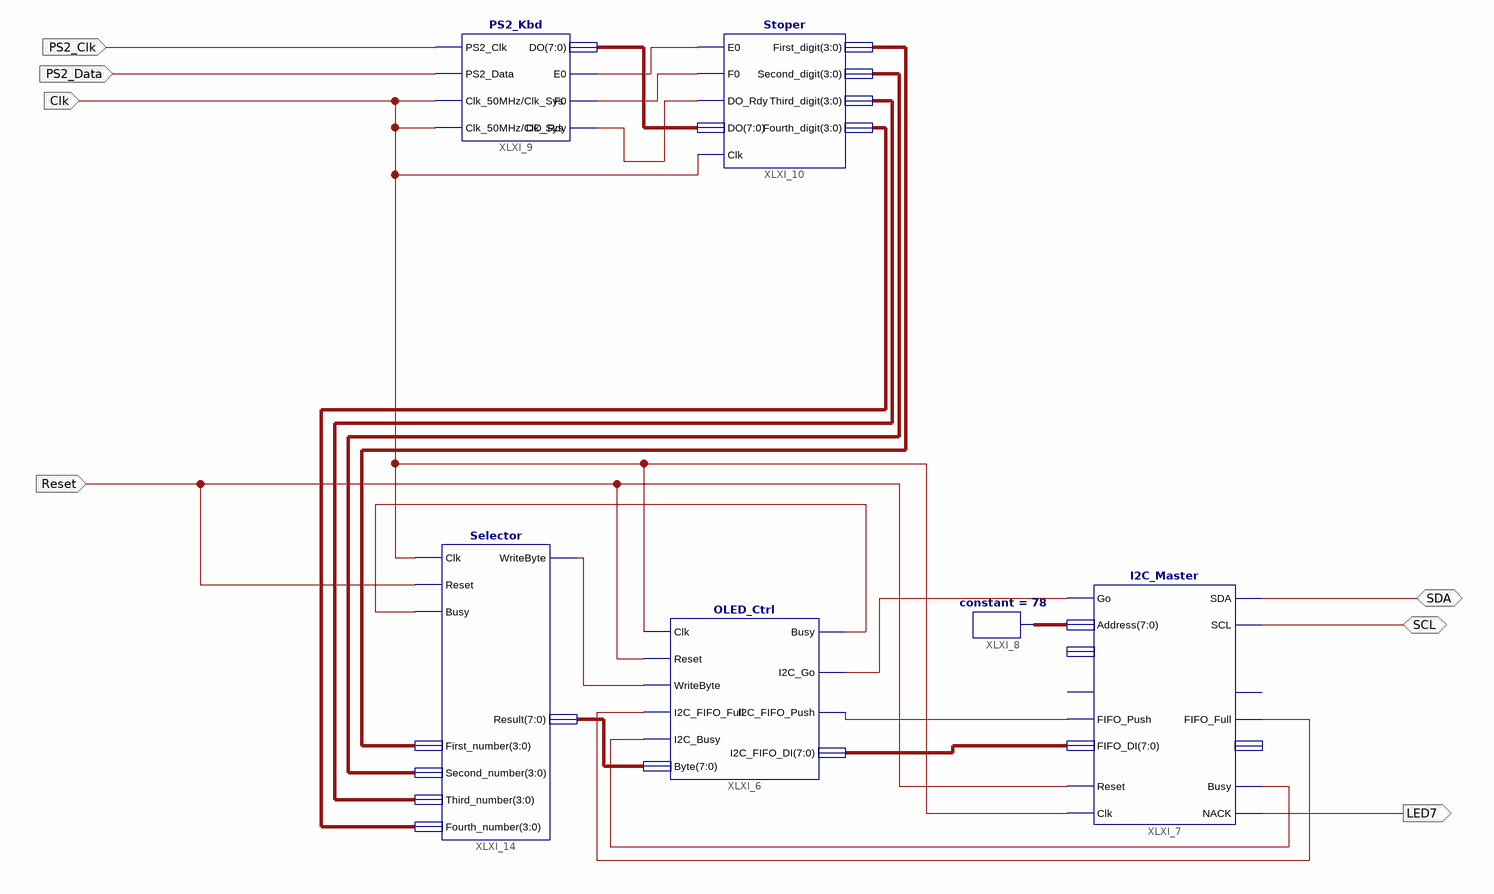
[diagram p0: schematic sheet 1]
// Xilinx ISE schematic Main.sch (spartan3e) as structural Verilog: 6 symbols, 7 ports
module Main (
  input  Reset,
  input  Clk,
  input  PS2_Clk,
  input  PS2_Data,
  inout  SDA,
  inout  SCL,
  output LED7
);

  wire XLXN_24, XLXN_27, XLXN_28, XLXN_29, XLXN_30, XLXN_44, XLXN_45, XLXN_46, XLXN_59;
  wire [3:0] XLXN_47, XLXN_48, XLXN_49, XLXN_50;
  wire [7:0] XLXN_25, XLXN_26, XLXN_43, XLXN_60;

  OLED_Ctrl XLXI_6 (
    .Clk(Clk), .Reset(Reset), .WriteByte(XLXN_24), .I2C_FIFO_Full(XLXN_30), .I2C_Busy(XLXN_29),
    .Byte(XLXN_60), .Busy(XLXN_59), .I2C_Go(XLXN_28), .I2C_FIFO_Push(XLXN_27), .I2C_FIFO_DI(XLXN_26));
  I2C_Master XLXI_7 (
    .Go(XLXN_28), .Address(XLXN_25), .SDA(SDA), .SCL(SCL), .FIFO_Push(XLXN_27), .FIFO_DI(XLXN_26),
    .FIFO_Full(XLXN_30), .Reset(Reset), .Clk(Clk), .Busy(XLXN_29), .NACK(LED7));  // open: ReadCnt, FIFO_Pop, FIFO_Empty, FIFO_DO
  constant #(.CValue("78")) XLXI_8 (.O(XLXN_25));
  PS2_Kbd XLXI_9 (
    .PS2_Clk(PS2_Clk), .PS2_Data(PS2_Data), .Clk_50MHz(Clk), .E0(XLXN_44), .F0(XLXN_45), .DO_Rdy(XLXN_46),
    .DO(XLXN_43), .Clk_Sys(Clk));
  Stoper XLXI_10 (
    .E0(XLXN_44), .F0(XLXN_45), .Clk(Clk), .DO_Rdy(XLXN_46), .DO(XLXN_43), .First_digit(XLXN_47),
    .Second_digit(XLXN_48), .Third_digit(XLXN_49), .Fourth_digit(XLXN_50));
  Selector XLXI_14 (
    .Clk(Clk), .Reset(Reset), .Busy(XLXN_59), .First_number(XLXN_47), .Second_number(XLXN_48),
    .Third_number(XLXN_49), .Fourth_number(XLXN_50), .WriteByte(XLXN_24), .Result(XLXN_60));
endmodule
